# Altium schematic sheet schematic.SchDoc: Model 1
size Legal; DrawnBy: Jonathan Helm; Engineer: Jonathan Helm; Organization: Roddewig and Helm; PageSetup: Record=PageOptions|CenterHorizontal=True|CenterVertical=True|PrintScale=2.17|XCorrection=1.00|YCorrection=1.00|PrintKind=1|BorderSize=5000000|LeftOffset=0|BottomOffset=0|Orientation=2|PaperLength=1000|PaperWidth=1000|Scale=100|PaperSource=7|PrintQuality=-3|MediaType=1|DitherType=10|PrintScaleMode=1|PaperKind=A2|PaperIndex=66; DocumentName: Model 1
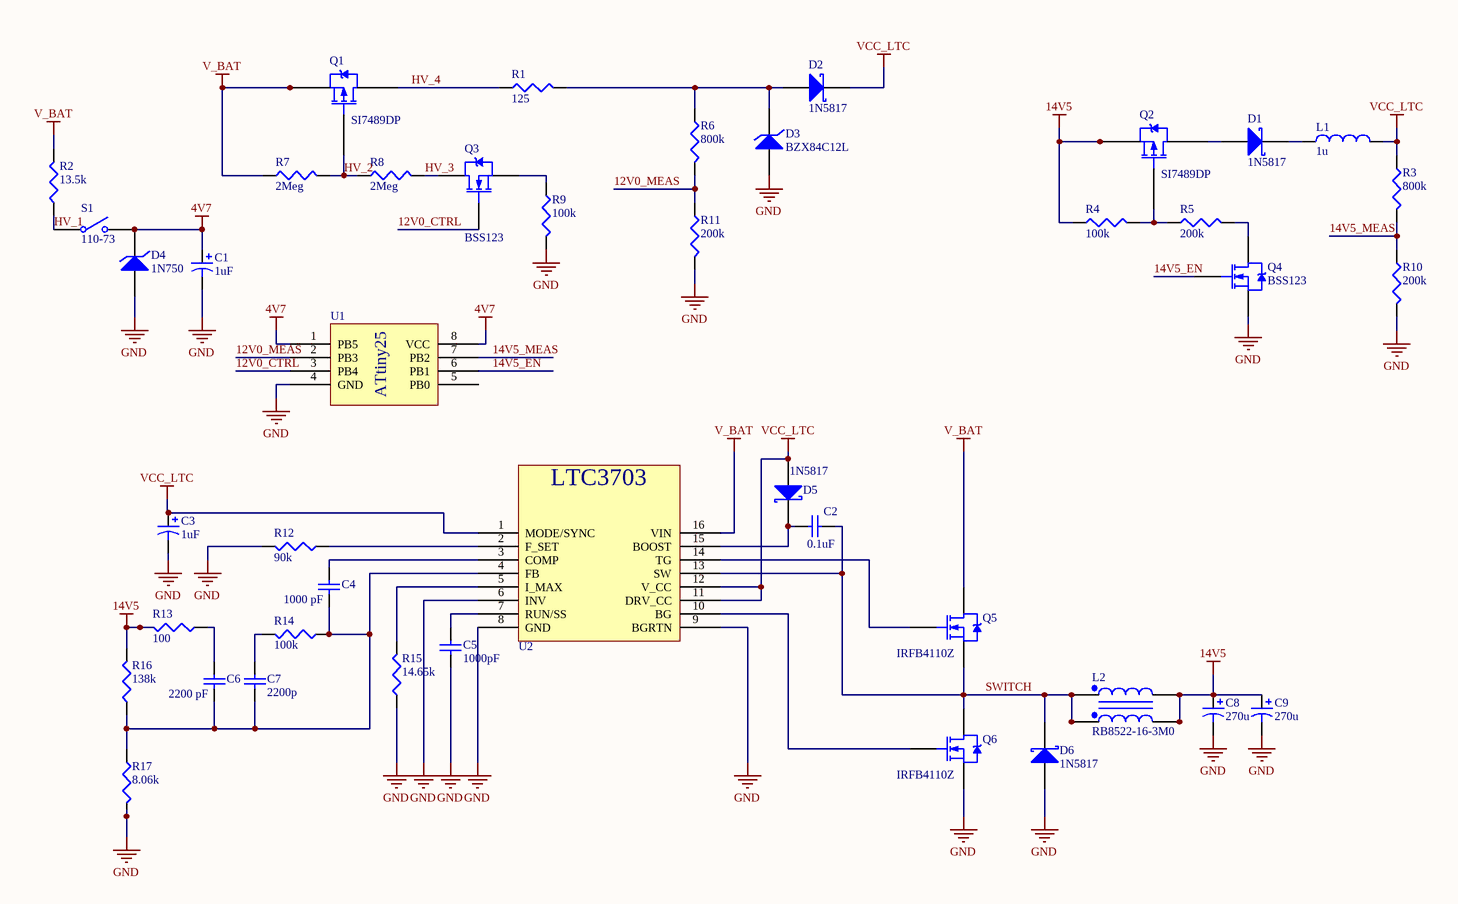
[diagram p0: schematic.SchDoc]

## Parts
C1  value 1uF  [EB Series Type A - 5mm]  (hidden comment: Capacitor-EB Series, Type A)
C2  value 0.1uF  [CAP0805]  (hidden comment: Capacitor)
C3  value 1uF  [EB Series Type A - 5mm]  (hidden comment: Capacitor-EB Series, Type A)
C4  value 1000 pF  [CAP0805]  (hidden comment: Capacitor)
C5  value 1000pF  [CAP0805]  (hidden comment: Capacitor)
C6  value 2200 pF  [CAP0805]  (hidden comment: Capacitor)
C7  value 2200p  [CAP0805]  (hidden comment: Capacitor)
C8  value 270u  [EB Series Type A - 8mm]  (hidden comment: Capacitor-EB Series, Type A)
C9  value 270u  [EB Series Type A - 8mm]  (hidden comment: Capacitor-EB Series, Type A)
D1  1N5817  [DO-41]
D2  1N5817  [DO-41]
D3  BZX84C12L  [3-Lead SOT-23]
D4  1N750  [DO-35]
D5  1N5817  [DO-41]
D6  1N5817  [DO-41]
L1  value 1u  [RES1206]  (hidden comment: Inductor)
L2  RB8522-16-3M0  [RB8522-16-3M0]
Q1  SI7489DP  [PowerPAK SO-8]
Q2  SI7489DP  [PowerPAK SO-8]
Q3  BSS123  [3-Lead SOT-23]
Q4  BSS123  [3-Lead SOT-23]
Q5  IRFB4110Z  [TO-220]
Q6  IRFB4110Z  [TO-220]
R1  value 125  [RES1206]  (hidden comment: Resistor)
R2  value 13.5k  [RES1206]  (hidden comment: Resistor)
R3  value 800k  [RES0805]  (hidden comment: Resistor)
R4  value 100k  [RES0805]  (hidden comment: Resistor)
R5  value 200k  [RES0805]  (hidden comment: Resistor)
R6  value 800k  [RES0805]  (hidden comment: Resistor)
R7  value 2Meg  [RES0805]  (hidden comment: Resistor)
R8  value 2Meg  [RES0805]  (hidden comment: Resistor)
R9  value 100k  [RES0805]  (hidden comment: Resistor)
R10  value 200k  [RES0805]  (hidden comment: Resistor)
R11  value 200k  [RES0805]  (hidden comment: Resistor)
R12  value 90k  [RES0805]  (hidden comment: Resistor)
R13  value 100  [RES0805]  (hidden comment: Resistor)
R14  value 100k  [RES0805]  (hidden comment: Resistor)
R15  value 14.65k  [RES0805]  (hidden comment: Resistor)
R16  value 138k  [RES0805]  (hidden comment: Resistor)
R17  value 8.06k  [RES0805]  (hidden comment: Resistor)
S1  110-73  [100-73]
U1  ATtiny25  [PDIP-8]  (value not drawn)
U2  LTC3703  [SSOP-16]  (value not drawn)

## Nets
4V7: C1.1 D4.1(K) S1.2(NO) U1.1(PB5) U1.8(VCC)
14V5: C8.1 C9.1 L2.5 L2.6 L2.7 L2.8 Q2.1(S) Q2.2(S) Q2.3(S) R4.1 R13.2 R16.2
GND: C1.2 C3.2 C5.1 C8.2 C9.2 D3.1(A) D4.2(A) D6.2(A) Q4.3(S) Q6.3(S) R9.2 R10.2 R11.2 R12.2 R15.1 R17.2 U1.4(GND) U2.6(INV) U2.8(GND) U2.9(BGRTN)
V_BAT: Q1.1(S) Q1.2(S) Q1.3(S) Q5.2(D) R2.2 R7.1 U2.16(VIN)
VCC_LTC: C3.1 D2.1(K) D5.2(A) L1.2 R3.1 U2.1(MODE/SYNC) U2.11(DRV_CC) U2.12(V_CC)
12V0_CTRL: Q3.1(G) U1.3(PB4)
12V0_MEAS: R6.2 R11.1 U1.2(PB3)
14V5_EN: Q4.1(G) U1.6(PB1)
14V5_MEAS: R3.2 R10.1 U1.7(PB2)
HV_1: R2.1 S1.1(COMMON)
HV_2: Q1.4(G) R7.2 R8.1
HV_3: Q3.2(D) R8.2
HV_4: Q1.5(D) R1.1
SWITCH: C2.2 D6.1(K) L2.1 L2.2 L2.3 L2.4 Q5.3(S) Q6.2(D) U2.13(SW)
NetC2_1: C2.1 D5.1(K) U2.15(BOOST)
NetC4_1: C4.1 C6.2 C7.1 R14.1 R16.1 R17.1 U2.4(FB)
NetC4_2: C4.2 U2.3(COMP)
NetC5_2: C5.2 U2.7(RUN/SS)
NetC6_1: C6.1 R13.1
NetC7_2: C7.2 R14.2
NetD1_1: D1.1(K) L1.1
NetD1_2: D1.2(A) Q2.5(D)
NetD2_2: D2.2(A) D3.3(K) R1.2 R6.1
NetQ2_4: Q2.4(G) R4.2 R5.1
NetQ3_3: Q3.3(S) R9.1
NetQ4_2: Q4.2(D) R5.2
NetQ5_1: Q5.1(G) U2.14(TG)
NetQ6_1: Q6.1(G) U2.10(BG)
NetR12_1: R12.1 U2.2(F_SET)
NetR15_2: R15.2 U2.5(I_MAX)

Not connected (* = marked no-connect by the designer): U1 5(PB0)

## Notes on the sheet
- Title
- Size:
- Date:
- Legal
- Number:
- Time:
- Revision:
- Sheet
- of
- File:

## Library data of the parts
C1 C3 = Capacitor-EB Series, Type A: Electrolytic Capacitor
  C1: ClassName: ATtiny
  C3: ComponentClass: LTC3703; ClassName: LTC3703
C8 C9 = Capacitor-EB Series, Type A: Electrolytic Capacitor; Model: EEU-EB1E331; ComponentClass: CVTR; ClassName: CVTR
C2 C4-C7 = Capacitor: ComponentClass: LTC3703; ClassName: LTC3703
D1 D2 D5 D6 = 1N5817
  D1 D2: ClassName: ATtiny
  D5: ComponentClass: LTC3703; ClassName: LTC3703
  D6: ComponentClass: CVTR; ClassName: CVTR
D3 = BZX84C12L: ClassName: ATtiny
D4 = 1N750: ClassName: ATtiny
L1 = Inductor: ClassName: ATtiny
L2 = RB8522-16-3M0: ComponentClass: CVTR; ClassName: CVTR
Q1 Q2 = SI7489DP
  Q1: ClassName: HI_VOLTAGE
  Q2: ClassName: ATtiny
Q3 Q4 = BSS123
  Q3: ClassName: HI_VOLTAGE
  Q4: ClassName: ATtiny
Q5 Q6 = IRFB4110Z: ClassName: CVTR
R1-R17 = Resistor
  R1 R7 R8: ComponentClass: ATtiny; ClassName: HI_VOLTAGE
  R2: ClassName: HI_VOLTAGE
  R3-R6 R9-R11: ClassName: ATtiny
  R12-R17: ComponentClass: LTC3703; ClassName: LTC3703
S1 = 110-73: ComponentClass: ATtiny; ClassName: HI_VOLTAGE
U1 = ATtiny25: ClassName: ATtiny
U2 = LTC3703: ClassName: LTC3703